# Altium schematic sheet USB.SchDoc
size A
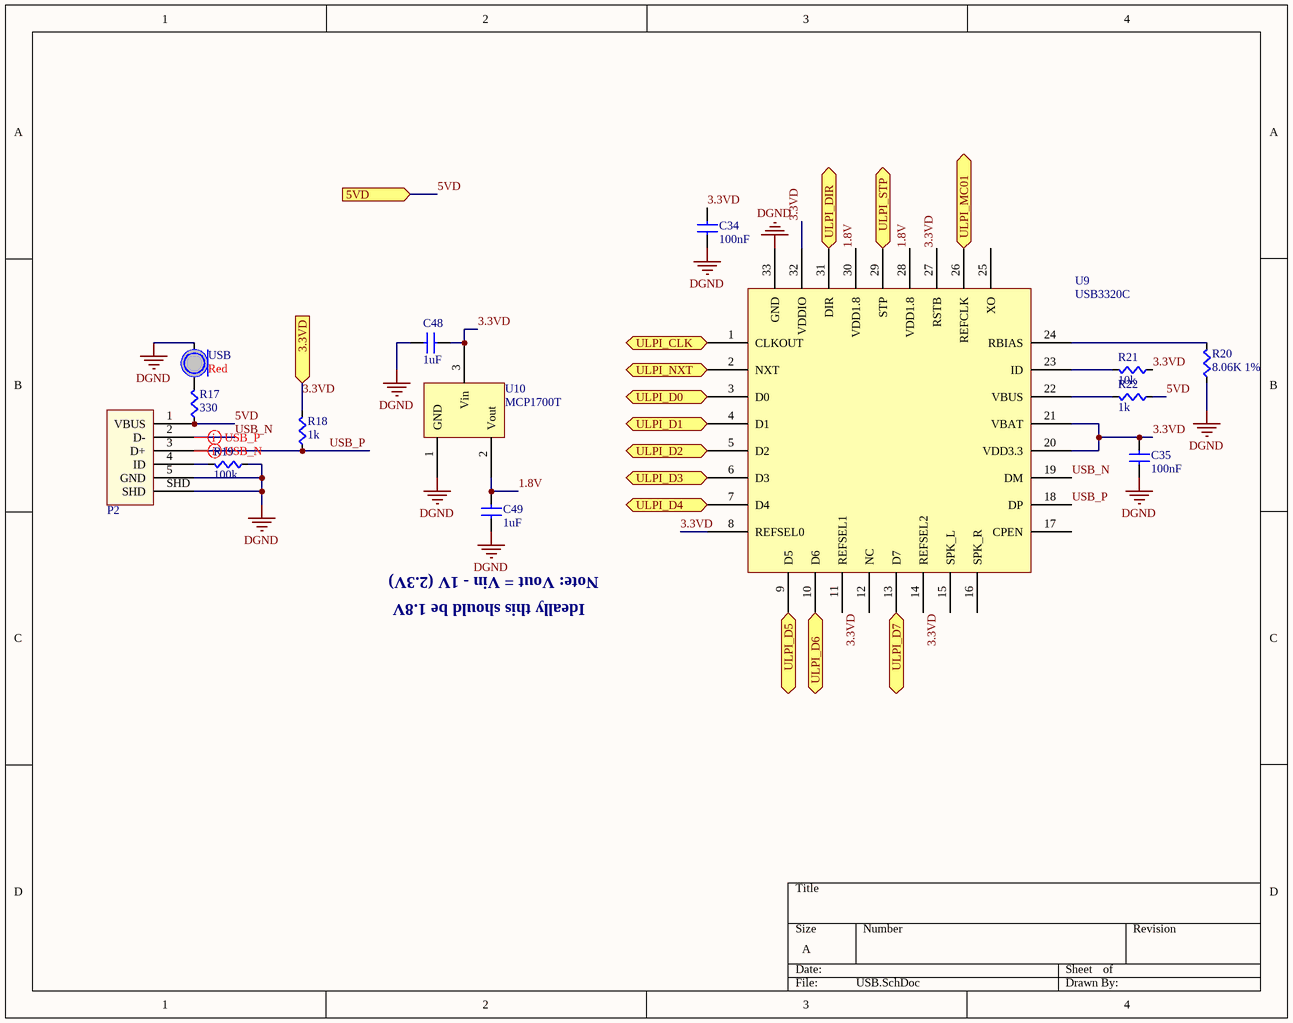
[diagram p0: USB.SchDoc]

## Parts
C34  value 100nF  [CAPC0603]  (hidden comment: Cap)
C35  value 100nF  [CAPC0603]  (hidden comment: Cap)
C48  value 1uF  [CAPC0603]  (hidden comment: Cap)
C49  value 1uF  [CAPC0603]  (hidden comment: Cap)
P2  USB Micro  [10118192-0001LF]  (value not drawn)
R17  value 330  [RES0603]  (hidden comment: Res)
R18  value 1k  [RES0603]  (hidden comment: Res)
R19  value 100k  [RES0603]  (hidden comment: Res)
R20  value 8.06K 1%  [RES0603]  (hidden comment: Res)
R21  value 10k  [RES0603]  (hidden comment: Res)
R22  value 1k  [RES0603]  (hidden comment: Res)
U9  USB3320C  [QFN-32]
U10  MCP1700T  [SOT23-3]
USB  Color: Red  [LED0805]  (hidden comment: LED)

## Ports
3.3VD (in), 5VD (in), ULPI_CLK (bidir), ULPI_D0 (bidir), ULPI_D1 (bidir), ULPI_D2 (bidir), ULPI_D3 (bidir), ULPI_D4 (bidir), ULPI_D5 (bidir), ULPI_D6 (bidir), ULPI_D7 (bidir), ULPI_DIR (bidir), ULPI_MC01 (bidir), ULPI_NXT (bidir), ULPI_STP (bidir)

## Nets
DGND: C34.2(B) C35.2(B) C48.2(B) C49.2(B) P2.5(GND) P2.SHD R19.2(B) R20.2(B) U9.33(GND) U10.1(GND) USB.C
1.8V: C49.1(A) U9.28(VDD1.8) U9.30(VDD1.8) U10.2(Vout)
3.3VD: C34.1(A) C35.1(A) C48.1(A) R18.1(A) R21.2(B) U9.8(REFSEL0) U9.11(REFSEL1) U9.14(REFSEL2) U9.20(VDD3.3) U9.21(VBAT) U9.27(RSTB) U9.32(VDDIO) U10.3(Vin) ; port 3.3VD
5VD: P2.1(VBUS) R17.2(B) R22.2(B) ; port 5VD
ULPI_CLK: U9.1(CLKOUT) ; port ULPI_CLK
ULPI_D0: U9.3(D0) ; port ULPI_D0
ULPI_D1: U9.4(D1) ; port ULPI_D1
ULPI_D2: U9.5(D2) ; port ULPI_D2
ULPI_D3: U9.6(D3) ; port ULPI_D3
ULPI_D4: U9.7(D4) ; port ULPI_D4
ULPI_D5: U9.9(D5) ; port ULPI_D5
ULPI_D6: U9.10(D6) ; port ULPI_D6
ULPI_D7: U9.13(D7) ; port ULPI_D7
ULPI_DIR: U9.31(DIR) ; port ULPI_DIR
ULPI_MC01: U9.26(REFCLK) ; port ULPI_MC01
ULPI_NXT: U9.2(NXT) ; port ULPI_NXT
ULPI_STP: U9.29(STP) ; port ULPI_STP
USB_N: P2.2(D-) U9.19(DM)
USB_P: P2.3(D+) R18.2(B) U9.18(DP)
NetP2_4: P2.4(ID) R19.1(A)
NetR17_1: R17.1(A) USB.A
NetR20_1: R20.1(A) U9.24(RBIAS)
NetR21_1: R21.1(A) U9.23(ID)
NetR22_1: R22.1(A) U9.22(VBUS)

Not connected (* = marked no-connect by the designer): U9 12(NC) 15(SPK_L) 16(SPK_R) 17(CPEN) 25(XO)

## Layout directives
differential pair: USB_N, USB_P

## Notes on the sheet
- Note: Vout = Vin - 1V (2.3V)
- Ideally this should be 1.8V

## Library data of the parts
P2 = USB Micro: USB Mini B Metal Shield SMT; Supplier 1: Digi-Key; Supplier Part Number 1: 609-4613-1-ND
U9 = USB3320C: MULTI-FREQ USB 2.0 ULPI PHY; Supplier Part Number 1: USB3320C-EZK-ND; Supplier 1: Digi-Key
U10 = LDO 1.8V: IC REG LDO 1.8V 0.2A SOT23-3; Supplier 1: Digi-Key; Supplier Part Number 1: MCP1700T1802ETTCT-ND
C34 C35 C48 C49 = Cap: Supplier 1: Digi-Key; Supplier Part Number 1: 1276-1000-1-ND
R17-R22 = Res: Supplier 1: Digi-Key; Supplier Part Number 1: RMCF0603JT10K0CT-ND
USB = LED: Supplier 1: Digi-Key; Supplier Part Number 1: 754-1122-1-ND